# EAGLE design Cover (EAGLE 6.5.0)
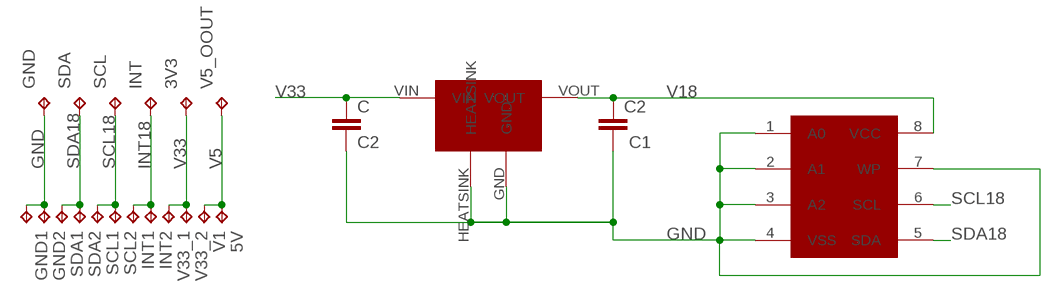
[diagram p0: schematic, sheet 1]

## Parts
3V3  TPTP20SQ  [TP20SQ]
5V  V5  TPTP20SQ  [TP20SQ]
C  C2  C-EUC0603  [C0603]
C2  C1  C-EUC0603  [C0603]
GND  TPTP20SQ  [TP20SQ]
GND1  TPTP20SQ  [TP20SQ]
GND2  TPTP20SQ  [TP20SQ]
INT  TPTP20SQ  [TP20SQ]
INT1  TPTP20SQ  [TP20SQ]
INT2  TPTP20SQ  [TP20SQ]
SCL  TPTP20SQ  [TP20SQ]
SCL1  TPTP20SQ  [TP20SQ]
SCL2  TPTP20SQ  [TP20SQ]
SDA  TPTP20SQ  [TP20SQ]
SDA1  SDA  TPTP20SQ  [TP20SQ]
SDA2  SDA  TPTP20SQ  [TP20SQ]
U$1  CAT24  [CAT24]
U$2  MCP1700-DFN6  [DFN6-2X2]
V1  V5  TPTP20SQ  [TP20SQ]
V5_OOUT  TPTP20SQ  [TP20SQ]
V33_1  TPTP20SQ  [TP20SQ]
V33_2  TPTP20SQ  [TP20SQ]

## Nets
GND: C2.2 C.2 GND1.TP GND2.TP GND.TP U$1.1(A0) U$1.2(A1) U$1.3(A2) U$1.4(VSS) U$1.7(WP) U$2.GND U$2.HEATSINK
INT18: INT1.TP INT2.TP INT.TP
SCL18: SCL1.TP SCL2.TP SCL.TP U$1.6(SCL)
SDA18: SDA1.TP SDA2.TP SDA.TP U$1.5(SDA)
V5: 5V.TP V1.TP V5_OOUT.TP
V18: C2.1 U$1.8(VCC) U$2.VOUT
V33: 3V3.TP C.1 U$2.VIN V33_1.TP V33_2.TP

## Library data of the parts
3V3 5V GND GND1 GND2 INT INT1 INT2 SCL SCL1 SCL2 SDA SDA1 SDA2 V1 V5_OOUT V33_1 V33_2 = testpad:TP: Test pad
C C2 = rcl:C-EU: CAPACITOR, European symbol
U$1 = cat24:CAT24
U$2 = MCP1700_DFN6-2x2:MCP1700-DFN6

## Board
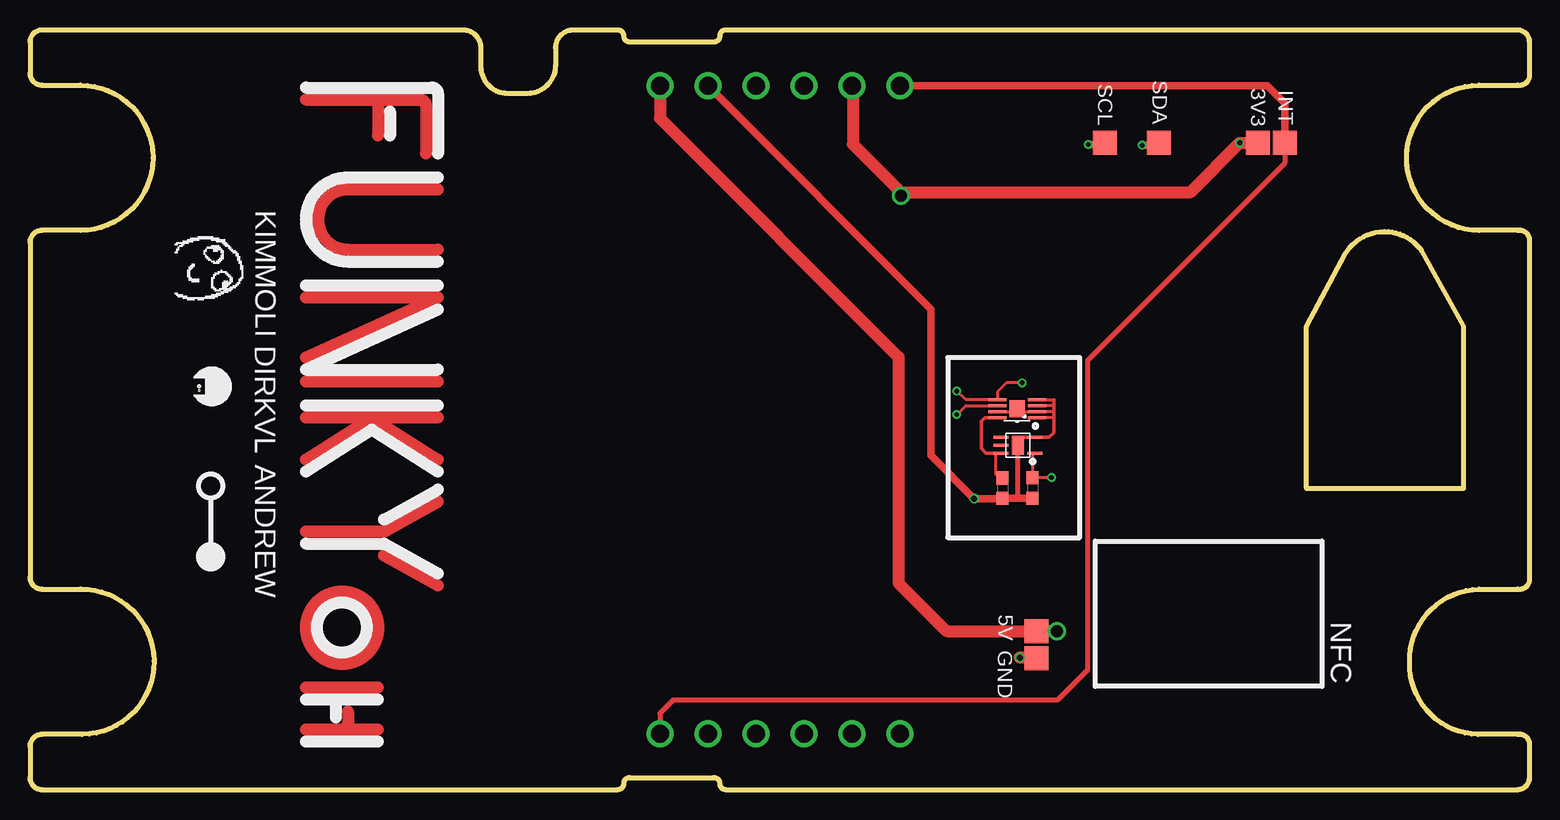
[diagram p1: board, top side]
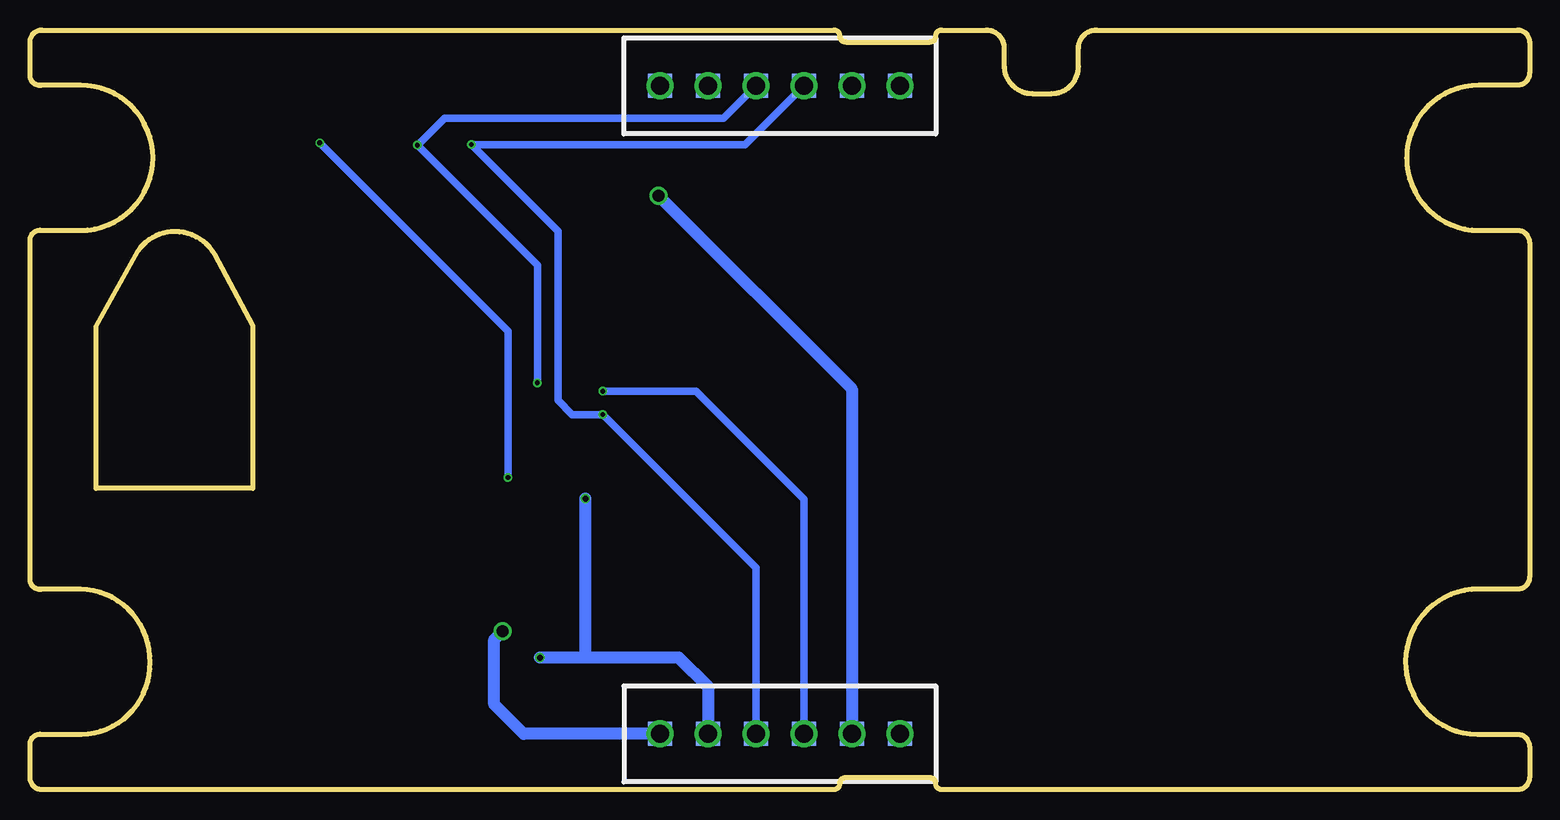
[diagram p2: board, bottom side, seen from below]

Size 125 x 63.3 mm. Coordinates in mm from the lower left corner, seen from the top.
Outline: 0,3.6 0,1 arc90 1,0 49,0 arc90 49.5,0.5 arc-90 50,1 57,1 arc-90 57.5,0.5 arc90 58,0 123.99,0 arc90 125,1.01 125,3.89 arc90 123.99,4.6 120.7,4.6 arc-90 115,10.6 arc-90 120.8,16.7 124,16.7 arc90 125,17.4 125,45.89 arc90 123.99,46.6 120.8,46.6 arc-180 120.8,58.7 124,58.7 arc90 125,59.4 125,62.3 arc90 124,63.3 58,63.3 arc90 57.5,62.8 arc-90 57,62.3 50,62.3 arc-90 49.5,62.8 arc90 49,63.3 45.3,63.3 arc90 43.8,61.8 43.8,60.35 arc-90 41.45,58 39.85,58 arc-90 37.6,60.25 37.6,61.8 arc90 36.1,63.3 1,63.3 arc90 0,62.3 0,59.7 arc90 1,58.7 4.2,58.7 arc-180 4.2,46.6 1.01,46.6 arc90 0,45.59 0,17.7 arc90 1,16.7 4.22,16.7 arc-180 4.35,4.6 1,4.6 arc90 0,3.6
Outline: 106.4,25.1 106.4,38.6 109.6,44.6 arc-59 112.9,46.5 arc-56 116,44.9 119.5,38.6 119.5,25.1 106.4,25.1
Copper layers (1*16): Top 0.035mm / dielectric 1.5mm / Bottom 0.035mm
Design rules "ITEADstudio_DRC": minimum track width 6mil, minimum drill 12mil, track to track 6mil, track to pad 6mil, pad to pad 6mil, via to via 6mil, smd to smd 0mil, copper to edge 10mil, drill to drill 10mil, minimum pad ring 10mil, minimum via ring 6mil, stop-mask expansion 2mil, vias tented up to drill 100mil, thermal gap 10mil
tRestrict: area 51.4,3.5 to 53.6,5.7; area 55.4,3.5 to 57.6,5.7; area 59.4,3.5 to 61.6,5.7; area 63.4,3.5 to 65.6,5.7; area 71.4,3.5 to 73.6,5.7; area 51.4,57.5 to 53.6,59.8; area 59.4,57.5 to 61.6,59.8; area 63.4,57.5 to 65.6,59.8; area 67.4,57.5 to 69.6,59.8; area 71.4,57.5 to 73.6,59.8

### Footprints (pad centres in the part's own frame; a part is rotated, then mirrored left to right if it is on the bottom)
TP20SQ = smd 2 x 2: TP 0,0
C0603 = smd 1.1 x 1: 1 -0.85,0; 2 0.85,0
CAT24 = smd 0.25 x 1.5: 1 -0.75,-1.65; 2 -0.25,-1.65; 3 0.25,-1.65; 4 0.75,-1.65; 5 0.75,1.65; 6 0.25,1.65; 7 -0.25,1.65; 8 -0.75,1.65 | smd 1.4 x 1.3: P$1 0,0
DFN6-2X2 = smd 1.25 x 0.25: GND -1.4,-0.65; P$1 1.4,0; P$2 1.4,-0.65; VIN -1.4,0.65; VOUT 1.4,0.65 | smd 1 x 1.6: HEATSINK 0,0

### Placement (x,y rotation side)
3V3  102.35,53.9 180 top
5V  83.9,13.2 0 top
C  83.58,25.13 270 top
C2  81.08,25.12 270 top
GND  83.9,10.95 0 top
GND1  56.5,58.65 0 bottom
GND2  68.5,4.65 0 bottom
INT  104.6,53.9 180 top
INT1  72.5,58.65 0 bottom
INT2  52.5,4.65 0 bottom
SCL  89.6,53.9 180 top
SCL1  60.5,58.65 0 bottom
SCL2  64.5,4.65 0 bottom
SDA  94.1,53.9 180 top
SDA1  64.5,58.65 0 bottom
SDA2  60.5,4.65 0 bottom
U$1  82.3,31.75 90 top
U$2  82.35,28.7 180 top
U$3  [FUNKY]  23,32.5 270 top
U$4  DAFUG  [DAFUG]  14.68,43.25 270 top
V1  52.5,58.65 0 bottom
V5_OOUT  72.5,4.65 0 bottom
V33_1  68.5,58.65 0 bottom
V33_2  56.5,4.65 0 bottom

### Tracks (layer width: path | path; a pad name or v marks a point on that pad's centre or on a via)
GND  (via drill 0.5, 1.5)
  Top 0.254: 82.4,29.35 82.35,29.3 U$2.HEATSINK | U$1.7 U$1.2 85.35,31.5 | 85.35,31 U$1.1 | 85.35,32 U$1.3 | U$1.4 85.35,32.5
  Top 0.305: 82.4,29.35 U$2.GND 84.95,29.35 85.35,29.75 85.35,31 85.35,31.5 85.35,32 85.35,32.5
  Top 0.406: 82.35,24.27 U$2.HEATSINK
  Top 0.61: C.2 82.35,24.27 C2.2 81.06,24.25 v78.7,24.25 75.1,27.85 75.1,40.05 GND1.TP
  Top 1.016: GND.TP 83.85,11 v82.5,11
  Bottom 1.016: GND2.TP 68.5,8.6 70.9,11 78.7,11 | 78.7,11 v78.7,24.25 | 78.7,11 v82.5,11
  other vias: 68.5,4.65 56.5,58.65
INT18  (via drill 1.5)
  Top 0.406: 104.6,53.85 104.6,52.2 88.15,35.75 88.15,9.95 85.65,7.45 53.6,7.45 52.5,6.35 INT2.TP
  Top 0.61: 104.6,53.85 INT.TP 104.6,57.2 103.15,58.65 INT1.TP
  Bottom 0.406: 52.4,4.95 INT2.TP
  other vias: 52.5,4.65 72.5,58.65
SCL18  (via drill 0.4, 1.5)
  Top 0.254: v77.25,31.25 78,32 U$1.6 | 89,53.8 SCL.TP
  Top 0.61: v88.2,53.75 89.6,53.75 SCL.TP
  Bottom 0.61: SCL2.TP 64.5,18.5 v77.25,31.25 79.8,31.25 81,32.45 81,46.55 v88.2,53.75 65.4,53.75 SCL1.TP
  other vias: 64.5,4.65 60.5,58.65
SDA18  (via drill 0.4, 1.5)
  Top 0.254: v77.25,33.2 78,32.5 U$1.5 80.65,33.15 81.4,33.9 v82.7,33.9
  Top 0.61: v92.7,53.7 94.1,53.7 SDA.TP
  Bottom 0.61: v82.7,33.9 82.7,43.7 v92.7,53.7 90.45,55.95 67.2,55.95 SDA1.TP | SDA2.TP 60.5,24.2 69.5,33.2 v77.25,33.2
  other vias: 60.5,4.65 64.5,58.65
V5  (via drill 1, 1.5)
  Top 1.016: V1.TP 52.5,55.95 72.4,36.05 72.4,17.2 76.4,13.2 5V.TP v85.6,13.2
  Bottom 1.016: V5_OOUT.TP 83.85,4.65 86.3,7.1 86.3,12.5 v85.6,13.2
  other vias: 72.5,4.65 52.5,58.65
V18
  Top 0.254: C2.1 81.2,25.57 80.5,26.27 80.5,28.05 U$2.VOUT | 80.5,31 U$1.8
  Top 0.305: 80.5,28.05 79.7,28.05 79.3,28.45 79.3,30.7 79.6,31 U$1.8
V33  (via drill 0.4, 1, 1.5)
  Top 0.254: U$2.VIN 83.58,28.05 C.1 83.6,26 v85.15,26
  Top 1.016: 3V3.TP v100.85,53.9 96.75,49.8 72.6,49.8 | 68.6,58.75 68.6,58.55 | 68.6,58.55 68.6,53.8 72.6,49.8 | V33_1.TP 68.6,58.55 | v72.6,49.5 72.6,49.8
  Bottom 0.61: v100.85,53.9 85.15,38.2 v85.15,26
  Bottom 1.016: V33_1.TP 68.6,58.75 | v72.6,49.5 56.5,33.4 V33_2.TP
  other vias: 56.5,4.65 68.5,58.65

### Text on the board
tPlace: KIMMOLI | DIRKVL | ANDREW | NFC